# Altium schematic sheet CANTransiver.SchDoc
size 250 x 176 mm; Date: 17.10.2024r.; Author: Bartłomiej Smoter; Revision: v1; SheetNumber: 3; SheetTotal: 6
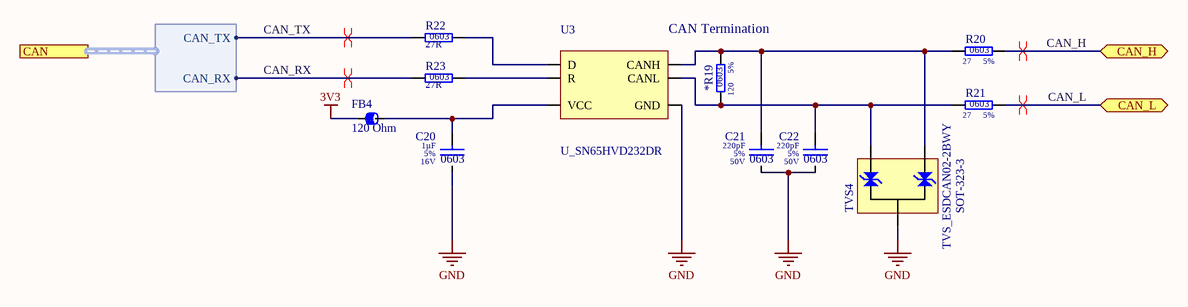
[diagram p0: CANTransiver.SchDoc]

## Parts
*R19  Tolerance: 5%  Resistance: 120  Case/Package: 0603  [0603_HandSold_Resistor]  (hidden comment: R_120_0603_5)
C20  value 1µF  Tolerance: 5%  Voltage Rating: 16V  Case/Package: 0603  [0603_HandSold_Capacitor]  (hidden comment: C_1u_16V_0603_5)
C21  value 220pF  Tolerance: 5%  Voltage Rating: 50V  Case/Package: 0603  [0603_HandSold_Capacitor]  (hidden comment: C_220p_50V_0603_5)
C22  value 220pF  Tolerance: 5%  Voltage Rating: 50V  Case/Package: 0603  [0603_HandSold_Capacitor]  (hidden comment: C_220p_50V_0603_5)
FB4  Impedance: 120 Ohm  [0805_FB]  (hidden comment: FB_BLM21PG121SN1D)
R20  Tolerance: 5%  Resistance: 27  Case/Package: 0603  [0603_HandSold_Resistor]  (hidden comment: R_27_0603_5)
R21  Tolerance: 5%  Resistance: 27  Case/Package: 0603  [0603_HandSold_Resistor]  (hidden comment: R_27_0603_5)
R22  value 27R  SCH_Footprint: 0603  [R_0603_1608]  (hidden comment: Resistor)
R23  value 27R  SCH_Footprint: 0603  [R_0603_1608]  (hidden comment: Resistor)
TVS4  TVS_ESDCAN02-2BWY  [SOT-323-3]
U3  U_SN65HVD232DR  [SOIC8]

## Ports
CAN (harness CAN, see Main[3C], MCU[1B]), CAN_H (bidir, see Main[2C]), CAN_L (bidir, see Main[2C])

## Harnesses
CAN: CAN_TX, CAN_RX

## Nets
3V3: FB4.1
GND: C20.2 C21.2 C22.2 TVS4.3 U3.2(GND)
CAN_H: R20.2 ; port CAN_H
CAN_L: R21.2 ; port CAN_L
CAN_RX: R23.1 ; port CAN.CAN_RX
CAN_TX: R22.1 ; port CAN.CAN_TX
Net*R19_1: *R19.1 C22.1 R21.1 TVS4.2 U3.6(CANL)
Net*R19_2: *R19.2 C21.1 R20.1 TVS4.1 U3.7(CANH)
NetC20_1: C20.1 FB4.2 U3.3(VCC)
NetR22_2: R22.2 U3.1(D)
NetR23_2: R23.2 U3.4(R)

## Layout directives
differential pair: CAN_H, CAN_L, CAN_RX, CAN_TX

## Notes on the sheet
- CAN Termination
- Name:
- Author:
- Project:
- Revision:
- Date:

## Library data of the parts
*R19 = CMP-009-00040-15: Power: 100mW; Voltage Rating: 50V; Revision Num.: 1; SCH_Footprint: 0603; Mounting Technology: SMT; HelpURL: https://www.tme.eu/Document/d2a72e545e5c8eb7bf2a04fa97535928/rc0603yageo.pdf
C20 = CMP-001-00014-23: Revision Num.: 1; Capacitor Type: Ceramic; HelpURL: https://eu.mouser.com/datasheet/2/40/KGM_X7R-3223212.pdf; Mounting Technology: SMT
C21 C22 = CMP-001-00019-21: Revision Num.: 1; Capacitor Type: Ceramic; Mounting Technology: SMT; Revision: 1; HelpURL: https://www.tme.eu/Document/bbf9b851c2f67970461c4f5edb477604/C0GNP0-Dielectric.pdf
FB4 = CMP-006-00000-9: Ferrite Beads 120 OHM 25% Alternate Sizing Guide Below; Revision Num.: Revision #1; ESR: 30m; Current Rating: 3A; Case/Package: 0805; HelpURL: https://www.mouser.pl/datasheet/2/281/ENFA0005-1915781.pdf; Mounting Technology: SMT; Man. Part Num.: BLM21PG121SN1D
R20 R21 = CMP-009-00038-16: Voltage Rating: 50V; Revision Num.: 1; Power: 100mW; HelpURL: https://www.mouser.pl/datasheet/2/54/cr-1858361.pdf; Mounting Technology: SMT
R22 R23 = R_27R_0603_1: Manufacturer: Vishay; Manufacturer Part Number: CRCW060327R0FKEAHP; Voltage: 75V; Power: 330mW; Tolerance: 1%; Part Number: R_27R_0603_1; HelpURL: https://www.vishay.com/docs/20043/crcwhpe3.pdf; Supplier 1: TME; Supplier 2: RS Components; Supplier 3: Farnell; Supplier Part Number 3: 1738883; Supplier 4: Mouser; Supplier Part Number 4: 71-CRCW060327R0FKEAH; Supplier 5: Digi-Key; Supplier Part Number 5: 541-27.0SCT-ND; Supplier 6: LCSC; Supplier Part Number 6: C313718
TVS4 = CMP-013-00005-12: Diode; 2x TVS; 26.5V 28.5V 44V; Revision Num.: 1; Polarity: Bidirectional; Case/Package: SOT-323-3; Breakdown Voltage: 28.5V; Mounting Technology: SMT; Man. Part Num.: ESDCAN02-2BWY; HelpURL: https://www.mouser.pl/datasheet/2/389/esdcan03_2bwy-1849066.pdf; Working Voltage: 26.5V; Clamping Voltage: 44V
U3 = CMP-013-00004-10: Transceiver; CAN; SN65HVD232; 1Mb/s; 3.3V SMT; Min Supply Voltage: 3V; Max Supply Voltage: 3.6V; Revision Num.: 1; HelpURL: https://www.ti.com/general/docs/suppproductinfo.tsp?distId=26&gotoUrl=https://www.ti.com/lit/gpn/sn65hvd230; Mounting Technology: SMT; Data Rate: 1Mb/s; Man. Part Num.: SN65HVD232DR; Series: SN65HVD232; Case/Package: SOIC8; Communication: CAN